# EAGLE schematic usb2ax_v3.1b (EAGLE 6.2)
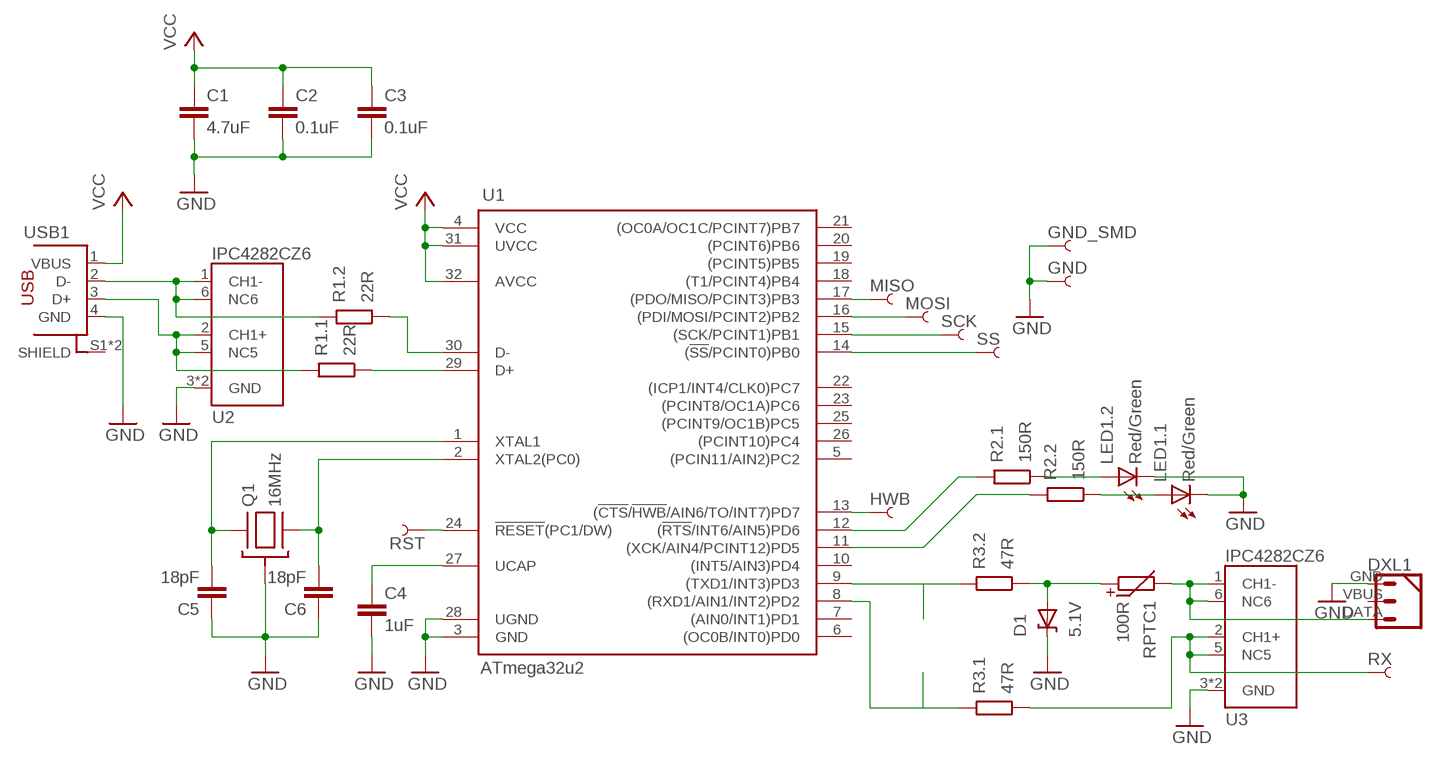
[diagram p0: schematic, sheet 1]

## Parts
C1  4.7uF  C0603  [0603_N]
C2  0.1uF  C0402  [0402_N]
C3  0.1uF  C0402  [0402_N]
C4  1uF  C0402  [0402_N]
C5  18pF  C0402  [0402_N]
C6  18pF  C0402  [0402_N]
D1  5.1V  DIODE_ZENER-923  [SOD-923_N]
DXL1  DYNAMIXEL_3POS  [DYMANIXEL_3POS_RIGHT]
GND  PIN_SMD_2X2.5  [PIN_SMD_2X2.5]
GND_SMD  PIN_SMD_2X2.5  [PIN_SMD_2X2.5]
HWB  PIN_SMD_2X2.5  [PIN_SMD_2X2.5]
LED1  Red/Green  LED_2  [D_2_0603_N]
MISO  PIN_SMD_2X2.5  [PIN_SMD_2X2.5]
MOSI  PIN_SMD_2X2.5  [PIN_SMD_2X2.5]
Q1  16MHz  CRYSTAL_W/BODY_403  [CRYSTAL_MODEL-403_N]
R1  22R  R_2-0402  [ARRAY_0402_65P_2_N]
R2  150R  R_2-0402  [ARRAY_0402_65P_2_N]
R3  47R  R_2-0402  [ARRAY_0402_65P_2_N]
RPTC1  100R  R-PTC0603  [0603_N]
RST  PIN_SMD_2X2.5  [PIN_SMD_2X2.5]
RX  PIN_THT_0.8  [PIN_0.8]
SCK  PIN_SMD_2X2.5  [PIN_SMD_2X2.5]
SS  PIN_SMD_2X2.5  [PIN_SMD_2X2.5]
U1  ATmega32u2  IC_ATMEGAXXU2-MU_L_MOD  [QFN-32_50P_L_MOD]
U2  IPC4282CZ6  [XSON6_N]
U3  IPC4282CZ6  [XSON6_N]
USB1  USB-STANDARD-PLUG_A_THT  [USB-A-THT]

## Nets
GND: C1.2 C2.2 C3.2 C4.2 C5.1 C6.1 D1.C DXL1.GND GND.PIN GND_SMD.PIN LED1.3(.2:C) LED1.4(.1:C) Q1.P$2(GND) Q1.P$4(GND) U1.3(GND) U1.28(UGND) U2.3(GND) U2.4(GND) U3.3(GND) U3.4(GND) USB1.4(GND)
HWB: HWB.PIN U1.13((!CTS!/!HWB!/AIN6/TO/INT7)PD7)
N$1: R3.4 U1.9((TXD1/INT3)PD3)
N$2: R3.3 U1.8((RXD1/AIN1/INT2)PD2)
N$3: C4.1 U1.27(UCAP)
N$4: D1.A R3.1 RPTC1.1
N$5: R2.4 U1.11((XCK/AIN4/PCINT12)PD5)
N$6: DXL1.DATA RPTC1.2 U3.1(CH1-) U3.6(NC6)
N$7: C6.2 Q1.P$3 U1.2(XTAL2(PC0))
N$8: C5.2 Q1.P$1 U1.1(XTAL1)
N$9: R1.1 U1.30(D-)
N$10: R1.2 U1.29(D+)
N$11: R1.4 U2.1(CH1-) U2.6(NC6) USB1.2(D-)
N$12: R1.3 U2.2(CH1+) U2.5(NC5) USB1.3(D+)
N$13: LED1.2(.2:A) R2.2
N$14: LED1.1(.1:A) R2.1
N$15: R2.3 U1.12((!RTS!/INT6/AIN5)PD6)
N$16: R3.2 RX.PIN U3.2(CH1+) U3.5(NC5)
N$17: MISO.PIN U1.17((PDO/MISO/PCINT3)PB3)
N$18: MOSI.PIN U1.16((PDI/MOSI/PCINT2)PB2)
N$19: SCK.PIN U1.15((SCK/PCINT1)PB1)
N$20: SS.PIN U1.14((!SS!/PCINT0)PB0)
RST: RST.PIN U1.24(!RESET!(PC1/DW))
VCC: C1.1 C2.1 C3.1 U1.4(VCC) U1.31(UVCC) U1.32(AVCC) USB1.1(VBUS)
Unconnected: DXL1.VBUS U1.5((PCIN11/AIN2)PC2) U1.6((OC0B/INT0)PD0) U1.7((AIN0/INT1)PD1) U1.10((INT5/AIN3)PD4) U1.18((T1/PCINT4)PB4) U1.19((PCINT5)PB5) U1.20((PCINT6)PB6) U1.21((OC0A/OC1C/PCINT7)PB7) U1.22((ICP1/INT4/CLK0)PC7) U1.23((PCINT8/OC1A)PC6) U1.25((PCINT9/OC1B)PC5) U1.26((PCINT10)PC4) USB1.S1(SHIELD) USB1.S2(SHIELD)

## Library data of the parts
C1-C6 = Xevelabs:C: Non-polarized Capacitor
D1 = Xevelabs:DIODE_ZENER: Zener Diode
DXL1 = Xevelabs:DYNAMIXEL_3POS
GND GND_SMD HWB MISO MOSI RST RX SCK SS = Xevelabs:PIN
LED1 = Xevelabs:LED_2: 2 LEDs array
Q1 = Xevelabs:CRYSTAL_W/BODY: Crystal oscillator, with connection to the body.
R1-R3 = Xevelabs:R_2: Resistor Array of 2.
RPTC1 = Xevelabs:R-PTC: PTC (Positive Temperature Coefficient) Resistor
U1 = Xevelabs:IC_ATMEGAXXU2
U2 U3 = Xevelabs:IPC4282CZ6: IPC4282CZ6 ESD suppressor from NXP
USB1 = Xevelabs:USB-STANDARD: USB (4 pins) connectors, plugs and receptacles.